# EAGLE design Adafruit PiUART USB C (EAGLE 9.6.2)
COMPANY: ADAFRUIT INDUSTRIES; DRAWN: KTOWN; REV: A
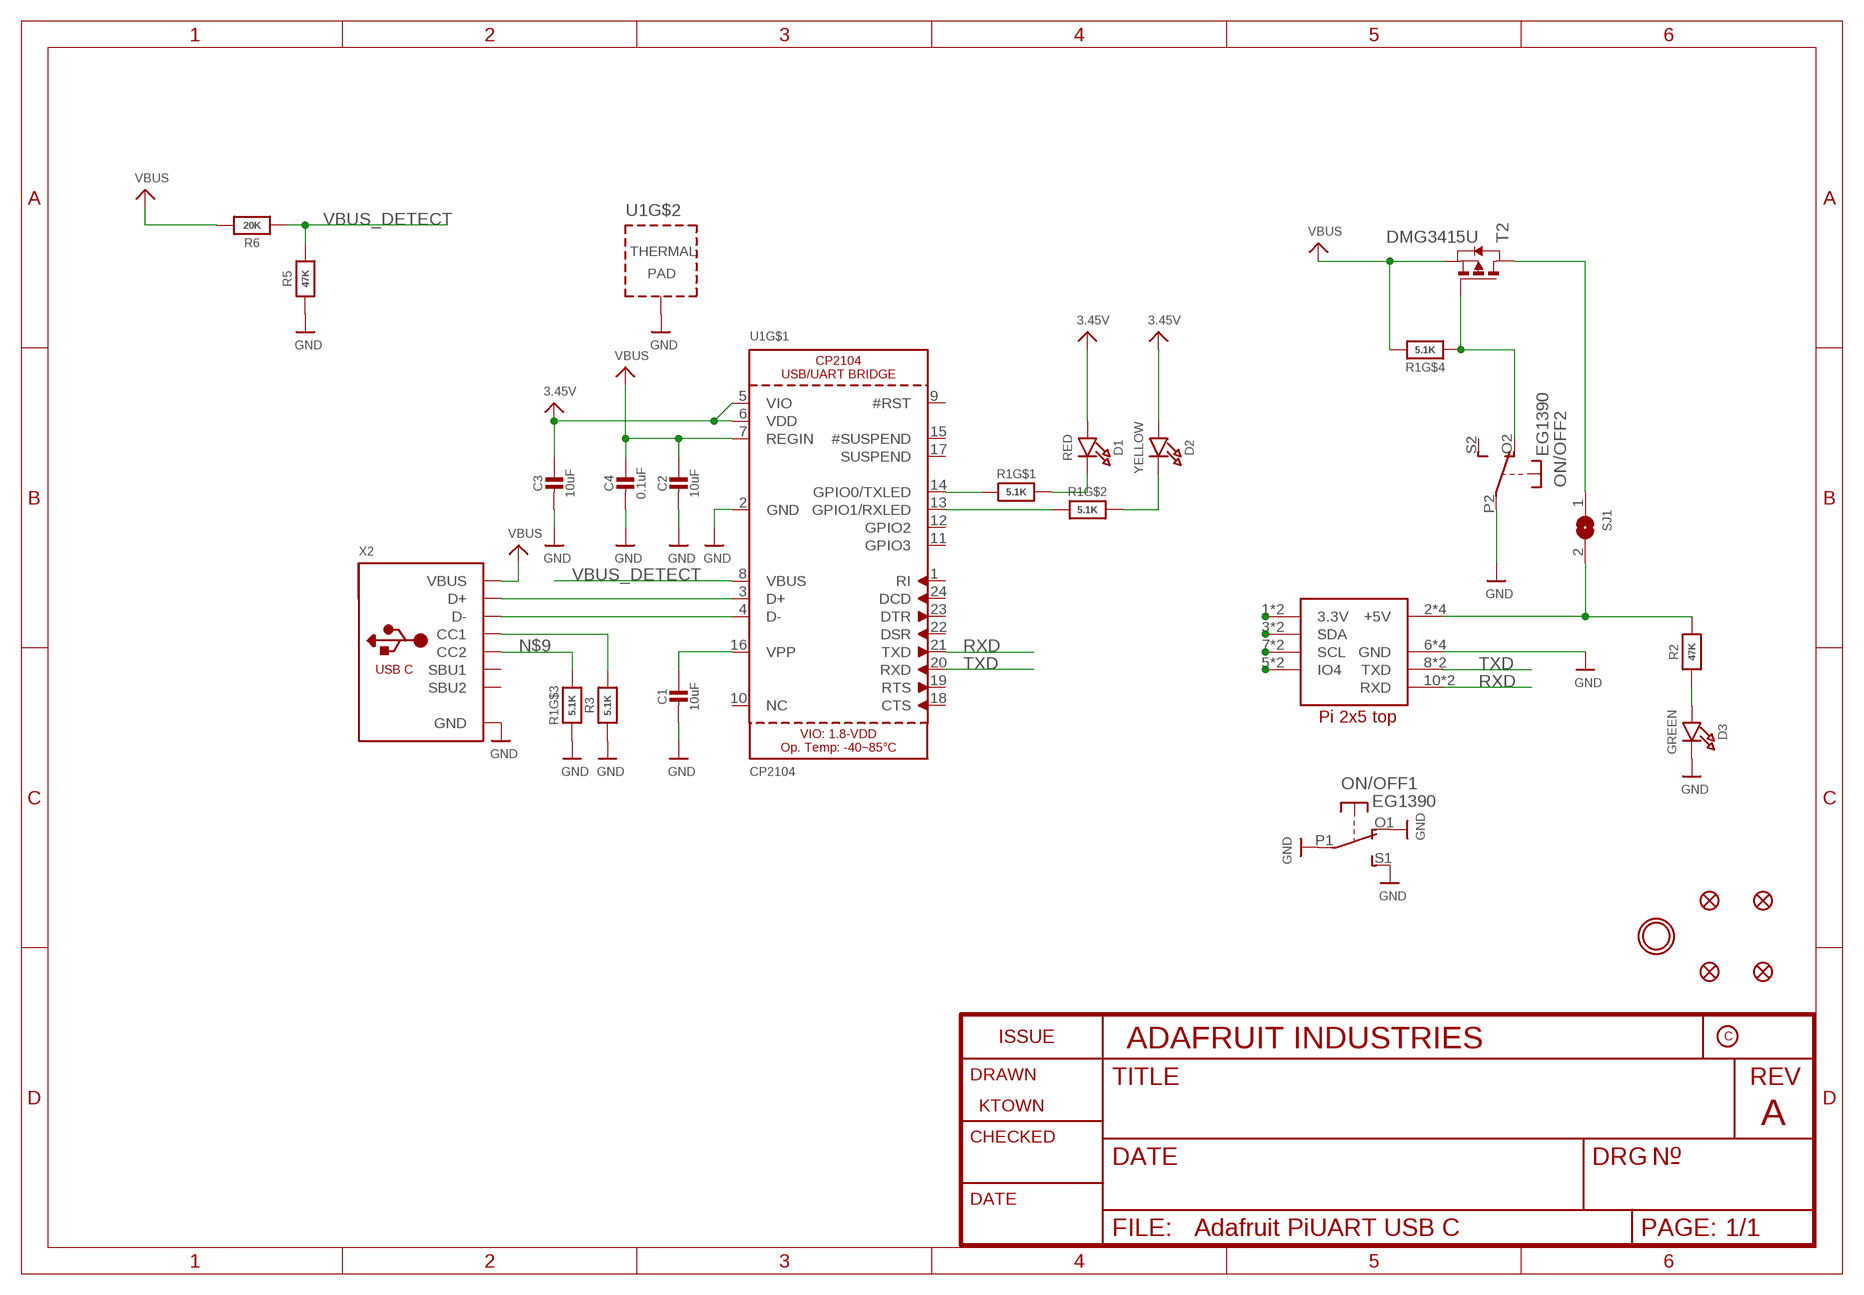
[diagram p0: schematic, sheet 1]

## Parts
C1  10uF  CAP_CERAMIC0805-NOOUTLINE  [0805-NO]
C2  10uF  CAP_CERAMIC0805-NOOUTLINE  [0805-NO]
C3  10uF  CAP_CERAMIC0805-NOOUTLINE  [0805-NO]
C4  0.1uF  CAP_CERAMIC0603_NO  [0603-NO]
D1  RED  LED0603_NOOUTLINE  [CHIPLED_0603_NOOUTLINE]
D2  YELLOW  LED0603_NOOUTLINE  [CHIPLED_0603_NOOUTLINE]
D3  GREEN  LED0603_NOOUTLINE  [CHIPLED_0603_NOOUTLINE]
FID1  FIDUCIAL_1MM  [FIDUCIAL_1MM]
FID2  FIDUCIAL_1MM  [FIDUCIAL_1MM]
FID3  FIDUCIAL_1MM  [FIDUCIAL_1MM]
FID4  FIDUCIAL_1MM  [FIDUCIAL_1MM]
ON/OFF  EG1390  DPDT-EG1390  [EG1390]
R1  5.1K  RESISTOR_4PACK  [RESPACK_4X0603]
R2  47K  RESISTOR_0603_NOOUT  [0603-NO]
R3  5.1K  RESISTOR_0603_NOOUT  [0603-NO]
R5  47K  RESISTOR_0603_NOOUT  [0603-NO]
R6  20K  RESISTOR_0603_NOOUT  [0603-NO]
SJ1  SOLDERJUMPERCLOSED  [SOLDERJUMPER_CLOSEDWIRE]
T2  DMG3415U  PMOSSOT23  [SOT-23]
U1  CP2104  [QFN24_4MM_SMSC]
U$9  RASPBERRYPI_2X5  [RASPBERRYPI_2X5_THMSMT]
U$18  MOUNTINGHOLE3.0THIN  [MOUNTINGHOLE_3.0_PLATEDTHIN]
X2  USB_C  [USB_C_CUSB31-CFM2AX-01-X]

## Nets
3.3V: C3.1 D1.A D2.A U1.5(VIO) U1.6(VDD) ; supply symbol labelled 3.45V
5V: R2.2 SJ1.2 U$9.2'(+5V) U$9.2(+5V) U$9.4'(+5V) U$9.4(+5V)
GND: C1.2 C2.2 C3.2 C4.2 D3.C ON/OFF.O1(1:O) ON/OFF.P1(1:P) ON/OFF.P2(2:P) ON/OFF.S1(1:S) R1.3 R3.1 R5.1 U1.2(GND) U1.THERM(TP) U$9.6'(GND) U$9.6(GND) U$9.9'(GND) U$9.9(GND) X2.A1B12(GND) X2.B1A12(GND)
N$1: D3.A R2.1
N$2: U1.3(D+) X2.A6(D+) X2.B6(D+)
N$3: U1.4(D-) X2.A7(D-) X2.B7(D-)
N$4: C1.1 U1.16(VPP)
N$5: R1.1 U1.14(GPIO0/TXLED)
N$6: D1.C R1.8
N$7: R1.2 U1.13(GPIO1/RXLED)
N$8: D2.C R1.7
N$9: R1.6 X2.B5(CC2)
N$10: R3.2 X2.A5(CC1)
N$13: ON/OFF.O2(2:O) R1.4 T2.3(G)
NC1: U$9.1'(3.3V) U$9.1(3.3V)
NC2: U$9.3'(SDA) U$9.3(SDA)
NC3: U$9.5'(IO4) U$9.5(IO4)
NC4: U$9.7'(SCL) U$9.7(SCL)
RXD: U1.21(TXD) U$9.10'(RXD) U$9.10(RXD)
TXD: U1.20(RXD) U$9.8'(TXD) U$9.8(TXD)
VBUS: C2.1 C4.1 R1.5 R6.2 T2.2(S) U1.7(REGIN) X2.A4B9(VBUS) X2.B4A9(VBUS)
VBUS_DETECT: R5.2 R6.1 U1.8(VBUS)
VIN [power]: SJ1.1 T2.1(D)
Unconnected: ON/OFF.S2(2:S) U1.1(RI) U1.9(#RST) U1.10(NC) U1.11(GPIO3) U1.12(GPIO2) U1.15(#SUSPEND) U1.17(SUSPEND) U1.18(CTS) U1.19(RTS) U1.22(DSR) U1.23(DTR) U1.24(DCD) X2.A8(SBU1) X2.B8(SBU2)

## Library data of the parts
C1-C4 = microbuilder:CAP_CERAMIC: Ceramic Capacitors For new designs, use the packages preceded by an '_' character since they are more reliable: The following footprints should be used on most boards: _0402 - Standard footprint for regular board layouts _0603 - Standard footprint for regular board layouts _0805 - Standard footprint for regular board layouts _1206 - Standard footprint for regular board layouts For extremely tight-pitch boards where space is at a premium, the following 'micro-pitch' footprints can be used (smaller pads, no silkscreen outline, etc.): _0402MP - Micro-pitch footprint for very dense/compact boards _0603MP - Micro-pitch footprint for very dense/compact boards _0805MP - Micro-pitch footprint for very dense/compact boards _1206MP - Micro-pitch footprint for very dense/compact boards
D1-D3 = microbuilder:LED: LED 0603 - 0603 Surface Mount Package 2mA: Green LED - Low Power (3.9mcd, 2ma, 1.7Vf) - Digikey: 475-2709-2-ND Orange LED - Low Power (9.8mcd, 2ma, 1.8Vf) - Digikey: 475-1194-2-ND Red LED - Low Power (5mcd, 2ma, 1.8Vf) - Digikey: 475-1195-2-ND Yellow LED - Low Power (7mcd, 2ma, 1.8Vf) - Digikey: 475-1196-2-ND 5mA: Blue LED - Low Power (17mcd, 5ma, 2.9Vf) - Digikey: LNJ937W8CRACT-ND 0805 - 0805 Surface Mount Package 2mA: Red LED (8.8mcd, 2mA, 1.8Vf, Clear) - Low Power [Digikey: 475-2510-1-ND] Green LED (5mcd, 2mA, 1.8Vf, Clear) - Low Power [Digikey: 475-2730-1-ND] Yellow LED (11.3mcd, 2mA, 1.8Vf, Clear) - Low Power [Digikey: 475-2555-1-ND] 20mA: Red LED (104mcd, 20mA, Diffused) - LS R976 [Digikey: 475-1278-6-ND] Red LED (12mcd, 20mA, 2.0Vf, Clear) - APT2012EC [Digikey: 754-1128-1-ND] Green LED (15mcd, 20mA, 2.2Vf, Clear) - APT2012GC [Digikey: 754-1131-1-ND] Orange LED (160mcd, 20mA, 2.1Vf, Clear) - APT2012SECK [Digikey: 754-1130-1-ND] 1206 - 1206 Surface Mount Package Green LED (26mcd, 20mA, Diffused) - LG N971 [Digikey: 475-1407-6-ND] Red LED (15mcd, 20mA, Diffused) - LH N974 [Digikey: 475-1416-6-ND] Cree - Cree High-Power Surface Mount LEDs XPEBWT-L1-0000-00D50 - White 111lm 350mA 2.9Vf 6200K 110° XTEAWT-00-0000-00000LEE3 - White 114lm 350mA 2.85Vf 5000K 115° Everlight - Everlight 45-21 Series Surface Mount LEDs 45-21/QK2C-B2832AC2CB2/2T - Warm White 2000mcd 20mA 3.25Vf 3050K 120° 45-21/LK2C-B38452C4CB2/2T - Nuetral White 2000mcd 20mA 3.25Vf 4150K 120° 45-21/LK2C-B50634C6CB2/2T - Cold White 2200mcd 20mA 3.25Vf 5650K 120° PLCC2 Reverse Mount LS T77K-J1L2-1-0-2-R18-Z - Red 11.25mcd 2mA 1.8Vf 630nm 120° LO T77K-L1M2-24-Z - Orange 19.6mcd 2mA 1.8Vf 606nm 120° LY T77K-K2M1-26-Z - Yellow 15.7mcd 2mA 1.8Vf 587nm 120°
FID1-FID4 = microbuilder:FIDUCIAL: Fiducial Alignment Points Various fiducial points for machine vision alignment.; BOM: EXCLUDE
ON/OFF = adafruit:DPDT
R1 = microbuilder:RESISTOR_4PACK: Resistor Packs (4 resistors) 4 x 0603 10K 1/16W - Digikey: YC164J-10KCT-ND
R2 R3 R5 R6 = microbuilder:RESISTOR: Resistors For new designs, use the packages preceded by an '_' character since they are more reliable: The following footprints should be used on most boards: _0402 - Standard footprint for regular board layouts _0603 - Standard footprint for regular board layouts _0805 - Standard footprint for regular board layouts _1206 - Standard footprint for regular board layouts For extremely tight-pitch boards where space is at a premium, the following 'micro-pitch' footprints can be used (smaller pads, no silkscreen outline, etc.): _0402MP - Micro-pitch footprint for very dense/compact boards _0603MP - Micro-pitch footprint for very dense/compact boards _0805MP - Micro-pitch footprint for very dense/compact boards _1206MP - Micro-pitch footprint for very dense/compact boards
SJ1 = microbuilder:SOLDERJUMPER: SMD Solder JUMPER Solder the two pads together to create a connection, or remove the solder to break it. REFLOW - Use this footprint for solder paste and reflow ovens. WAVE - Use this footprint for hand-soldering (larger pads). CLOSED - Has a trace between the two pads to ensure it is closed by default. The trace needs to be cut to disable the jumper, and can be closed again by creating a solder bridge between the two pads.
T2 = zetex:PMOSSOT23: MOS FET; OC_FARNELL: unknown; OC_NEWARK: unknown
U1 = microbuilder:CP2104: CP2104 - USB to UART Bridge VDD Output: 3.45V
U$9 = microbuilder:RASPBERRYPI_2X5
U$18 = microbuilder:MOUNTINGHOLE: Mounting Hole For #2 screws (0.086"/2.18mm width, 0.094"/2.4mm hole) use 2.5mm; BOM: EXCLUDE
X2 = adafruit_electromech:USB_C: USB Type-C USB 2.0 Connector

## Net classes
1 power: width 0.305 mm, drill 0.483 mm, clearance 0.203 mm
2 gnd: width 0.305 mm, drill 0.483 mm, clearance 0.203 mm

## Board
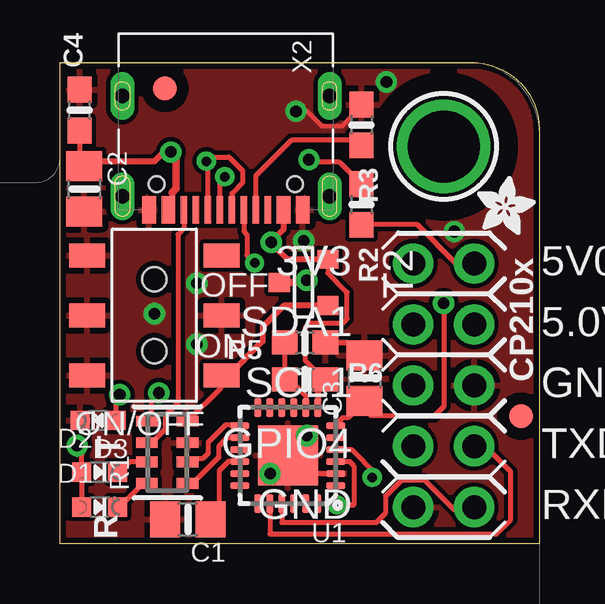
[diagram p1: board, top side]
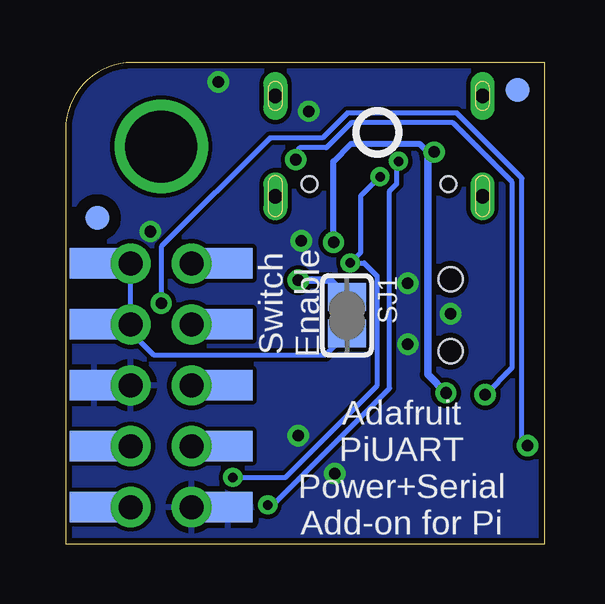
[diagram p2: board, bottom side, seen from below]

Size 19.99 x 20.07 mm. Coordinates in mm from the lower left corner, seen from the top.
Outline: 0,20.07 17.2,20.07 arc-90 19.99,17.27 19.99,0 0,0 0,20.07
Copper layers (1*16): Top 0.035mm / dielectric 1.5mm / Bottom 0.035mm
Design rules "adafruit 7-7": minimum track width 7mil, minimum drill 15.5mil, track to track 7mil, track to pad 7mil, pad to pad 7mil, via to via 7mil, smd to smd 7mil, copper to edge 10mil, drill to drill 8mil, minimum pad ring 7mil, minimum via ring 8mil, stop-mask expansion 2mil, vias tented up to drill 20mil, thermal gap 10mil

### Footprints (pad centres in the part's own frame; a part is rotated, then mirrored left to right if it is on the bottom)
0805-NO = smd 1.24 x 1.5: 1 -0.95,0; 2 0.95,0
0603-NO = smd 1.075 x 1: 1 -0.85,0; 2 0.85,0
CHIPLED_0603_NOOUTLINE = smd 0.8 x 0.8: A 0,-0.75; C 0,0.75
FIDUCIAL_1MM = smd 1 x 1: 1 0,0
EG1390 = smd 1 x 1.5: O1 -2.5,2.8; O2 -2.5,-2.8; P1 0,2.8; P2 0,-2.8; S1 2.5,2.8; S2 2.5,-2.8 | hole 1: 1.5,0; -1.5,0
RESPACK_4X0603 = smd 0.45 x 0.9: 1 -1.3,-0.85; 2 -0.4,-0.85; 3 0.4,-0.85; 4 1.3,-0.85; 5 1.3,0.85; 6 0.4,0.85; 7 -0.4,0.85; 8 -1.3,0.85
SOLDERJUMPER_CLOSEDWIRE = smd 1.168 x 1.6: 1 -0.762,0; 2 0.762,0 | smd 0.635 x 0.203: WIRE 0,0
SOT-23 = smd 0.787 x 0.889: 1 0.025,-1.016; 2 -0.94,1.016; 3 0.991,1.016
QFN24_4MM_SMSC = smd 0.8 x 0.28: 1 -2,1.25; 2 -2,0.75; 3 -2,0.25; 4 -2,-0.25; 5 -2,-0.75; 6 -2,-1.25; 13 2,-1.25; 14 2,-0.75; 15 2,-0.25; 16 2,0.25; 17 2,0.75; 18 2,1.25 | smd 0.28 x 0.8: 7 -1.25,-2; 8 -0.75,-2; 9 -0.25,-2; 10 0.25,-2; 11 0.75,-2; 12 1.25,-2; 19 1.25,2; 20 0.75,2; 21 0.25,2; 22 -0.25,2; 23 -0.75,2; 24 -1.25,2 | smd 2.5 x 2.5: THERM 0,0
RASPBERRYPI_2X5_THMSMT = drill 1 pad 1.676: 1 -1.27,5.08; 2 1.27,5.08; 3 -1.27,2.54; 4 1.27,2.54; 5 -1.27,0; 6 1.27,0; 7 -1.27,-2.54; 8 1.27,-2.54; 9 -1.27,-5.08; 10 1.27,-5.08 | smd 2.032 x 1.27 bottom: 1' -2.794,5.08; 2' 2.794,5.08; 3' -2.794,2.54; 4' 2.794,2.54; 5' -2.794,0; 6' 2.794,0; 7' -2.794,-2.54; 8' 2.794,-2.54; 9' -2.794,-5.08; 10' 2.794,-5.08
MOUNTINGHOLE_3.0_PLATEDTHIN = drill 3 pad 3.6: P$1 0,0
USB_C_CUSB31-CFM2AX-01-X = smd 0.575 x 1.15: A1B12 -3.2,3.545; A4B9 -2.4,3.545; B1A12 3.2,3.545; B4A9 2.4,3.545 | smd 0.275 x 1.15: A5 -1.25,3.545; A6 -0.25,3.545; A7 0.25,3.545; A8 1.25,3.545; B5 1.75,3.545; B6 0.75,3.545; B7 -0.75,3.545; B8 -1.75,3.545 | drill 0.6 pad 1 long: M1 -4.32,2.97; M2 4.32,2.97; M3 -4.32,-1.21; M4 4.32,-1.21 | hole 0.65: 2.89,2.47; -2.89,2.47

### Placement (x,y rotation side)
C1  5.33,1.02 180 top
C2  1.02,14.8 270 top
C3  12.7,6.9 90 top
C4  0.82,18.08 90 top
D1  1.65,1.52 270 top
D2  1.65,2.98 270 top
D3  1.59,5.14 90 top
FID1  19.22,5.31 0 top
FID2  4.38,18.99 0 top
FID3  18.67,13.59 0 bottom
FID4  1.14,18.92 0 bottom
ON/OFF  3.94,9.53 90 top
R1  4.47,3.81 90 top
R2  12.57,14.15 270 top
R3  12.57,17.46 270 top
R5  10.22,8.38 180 top
R6  10.22,6.86 0 top
SJ1  8.26,9.53 270 bottom
T2  10.16,10.92 270 top
U1  9.5,3.67 180 top
U$8  [ADAFRUIT_2.5MM]  17.4,12.89 0 top
U$9  16,6.6 0 top
U$17  [PCBFEAT-REV-040]  6.99,17.14 0 bottom
U$18  16,16.56 0 top
X2  6.92,17.46 180 top

### Tracks (layer width: path | path; a pad name or v marks a point on that pad's centre or on a via)
3.3V  (via drill 0.48)
  Top 0.203: D1.A D2.A 0.9,3.71 0.91,3.71 0.72,3.71 v0.72,4.1 | U1.5 U1.6 11.5,4.97 11.78,5.25 12.01,5.25 C3.1 12.95,5.71 12.95,5.33 15.62,5.33 16,5.71 v16,10.03
  Bottom 0.203: v16,10.03 16,12.38 11.46,16.92 9.28,16.92 8.24,17.96 3.67,17.96 0.95,15.24 0.95,4.27 0.78,4.1 v0.72,4.1
5V
  Top 0.203: U$9.2 16.51,11.68 14.9,13.3 R2.2
  Bottom 0.203: U$9.2' U$9.2 U$9.4 | U$9.4' U$9.4 | SJ1.2 9.14,7.87 16.32,7.87 17.27,8.83 U$9.4
GND  (via drill 0.48)
  Top 0.178: v9.84,18.03 10.3,18.03 10.92,17.41 11.75,17.41 12.57,18.22
  Top 0.203: 10.51,2.92 U1.2 | U1.THERM 9.95,4.12 9.95,4.51 v10.29,4.51 | R5.1 12.18,8.38 C3.2 | 12.57,18.22 R3.1
  Top 0.254: C1.2 4.38,1.21 | U1.THERM 10.25,2.92 10.51,2.92
  Bottom 0.203: U$9.6' U$9.6
  other vias: 8.76,2.92 10.16,12.64 13.61,19.25 3.94,9.59 16.45,13.02 5.71,8.32 5.71,10.86
  pour Top: 0,0 19.94,0 19.94,20 0,20
  pour Bottom: 0,0 19.94,0 19.94,20 0,20
N$1  (via drill 0.48)
  Top 0.203: D3.A 2.34,6.06 v2.49,6.21 | v10.38,16.02 10.49,15.9 11.66,15.9 R2.1
  Bottom 0.203: v2.49,6.21 1.36,7.34 1.36,15.07 3.84,17.55 8.07,17.55 9.11,16.52 10.22,16.52 10.38,16.36 v10.38,16.02
N$2  (via drill 0.39)
  Top 0.203: U1.3 12.07,3.42 12.26,3.24 12.26,1.62 v11.56,1.62 | X2.B6 6.17,15.89 | X2.A6 7.17,14.6 7.62,15.05 7.62,15.56 7.05,16.13 6.41,16.13 6.17,15.89 | v6.11,15.95 6.17,15.89
  Bottom 0.203: v11.56,1.62 11.34,1.62 6.48,6.48 6.48,14.71 6.17,15.01 6.17,15.89 v6.11,15.95
N$3  (via drill 0.39)
  Top 0.203: U1.4 12.17,3.92 13.18,2.92 v13.02,2.76 | X2.A7 6.67,15.1 v6.88,15.3 | X2.B7 7.67,13.03 7.8,12.9 7.8,12.03 v8.12,11.71
  Bottom 0.203: v13.02,2.76 10.83,2.76 6.99,6.6 6.99,11.15 7.54,11.71 v8.12,11.71 7.68,12.14 7.68,14.5 v6.88,15.3
N$4
  Top 0.203: U1.16 7.03,3.42 6.64,3.04 6.64,1.54 6.28,1.18 C1.1
N$5
  Top 0.203: U1.14 6.99,4.42 6.62,4.05 6.62,3.59 5.54,2.51 R1.1
N$6
  Top 0.203: R1.8 3.46,2.51 2.48,1.52 D1.C
N$7
  Top 0.203: R1.2 5.45,3.54 5.94,3.54 6.2,3.79 6.2,4.25 6.9,4.95 7.47,4.95 U1.13
N$8
  Top 0.203: R1.7 2.9,3.41 2.48,2.98 D2.C
N$9
  Top 0.203: X2.B5 5.17,13.15 4.92,12.9 4.92,5.87 4.38,5.33 4.38,4.76 3.83,4.21 R1.6
N$10
  Top 0.203: X2.A5 8.17,15.35 9.65,16.83 12.36,16.83 R3.2
N$13
  Top 0.203: R1.4 6.74,6.52 6.74,6.97 | 6.74,6.97 6.99,7.22 6.99,6.99 | 6.74,6.97 ON/OFF.O2
  Top 0.254: T2.3 9.34,9.93 8.45,9.04 8.45,8.45 6.99,6.99
NC1
  Bottom 0.203: U$9.1 U$9.1'
NC2
  Bottom 0.203: U$9.3 U$9.3'
NC3
  Bottom 0.203: U$9.5' U$9.5
NC4
  Bottom 0.203: U$9.7 U$9.7'
RXD
  Top 0.203: U1.21 9.25,0.89 13.19,0.89 13.59,1.29 13.59,2 14.26,2.67 15.21,2.67 16.47,1.4 17.15,1.4 U$9.10
  Bottom 0.203: U$9.10' U$9.10
TXD
  Top 0.203: U1.20 8.75,0.41 18.21,0.41 18.8,1 18.8,3 17.74,4.06 U$9.8
  Bottom 0.203: U$9.8' U$9.8
VBUS  (via drill 0.48)
  Top 0.203: R1.5 3.81,5.3 3.81,5.97 v4.13,6.29 | R6.2 11.01,6.86 10.23,7.64 10.23,9.01 10.43,9.21 11.81,9.21 11.98,9.37 11.98,10.48 11.18,11.28 T2.2 | C4.1 0.82,15.94 C2.1
  Top 0.254: 4.67,14.64 4.67,14.07 X2.B4A9 | C2.1 1.21,15.94 3.93,15.94 4.33,16.33 v4.62,16.33 4.85,16.1 | R6.2 10.76,6.54 10.75,6.54 U1.7 | X2.A4B9 9.32,13.09 8.81,12.58 v8.81,12.57 8.91,12.48 8.91,12.41 9.46,11.86 T2.2
  Top 0.305: 4.85,16.1 4.85,14.81 4.67,14.64
  Bottom 0.254: v8.81,12.57 8.83,12.59 8.83,15.94 8.08,16.68 5.23,16.68 4.88,16.33 v4.62,16.33
  Bottom 0.305: v4.13,6.29 4.89,7.05 4.89,16.07 v4.62,16.33
VBUS_DETECT
  Top 0.203: R5.2 R6.1 9.56,6.86 10.25,6.17 U1.8
VIN  (via drill 0.48)
  Top 0.305: v10.29,10.99 10.2,10.9 T2.1
  Bottom 0.305: v10.29,10.99 8.95,10.99 SJ1.1

### Text on the board
tPlace: OFF | ON | CP210x | T | R
bPlace: Switch / Enable | Adafruit / PiUART / Power+Serial / Add-on for Pi